# EAGLE schematic AudioAmplifierExample (EAGLE 9.6.2)
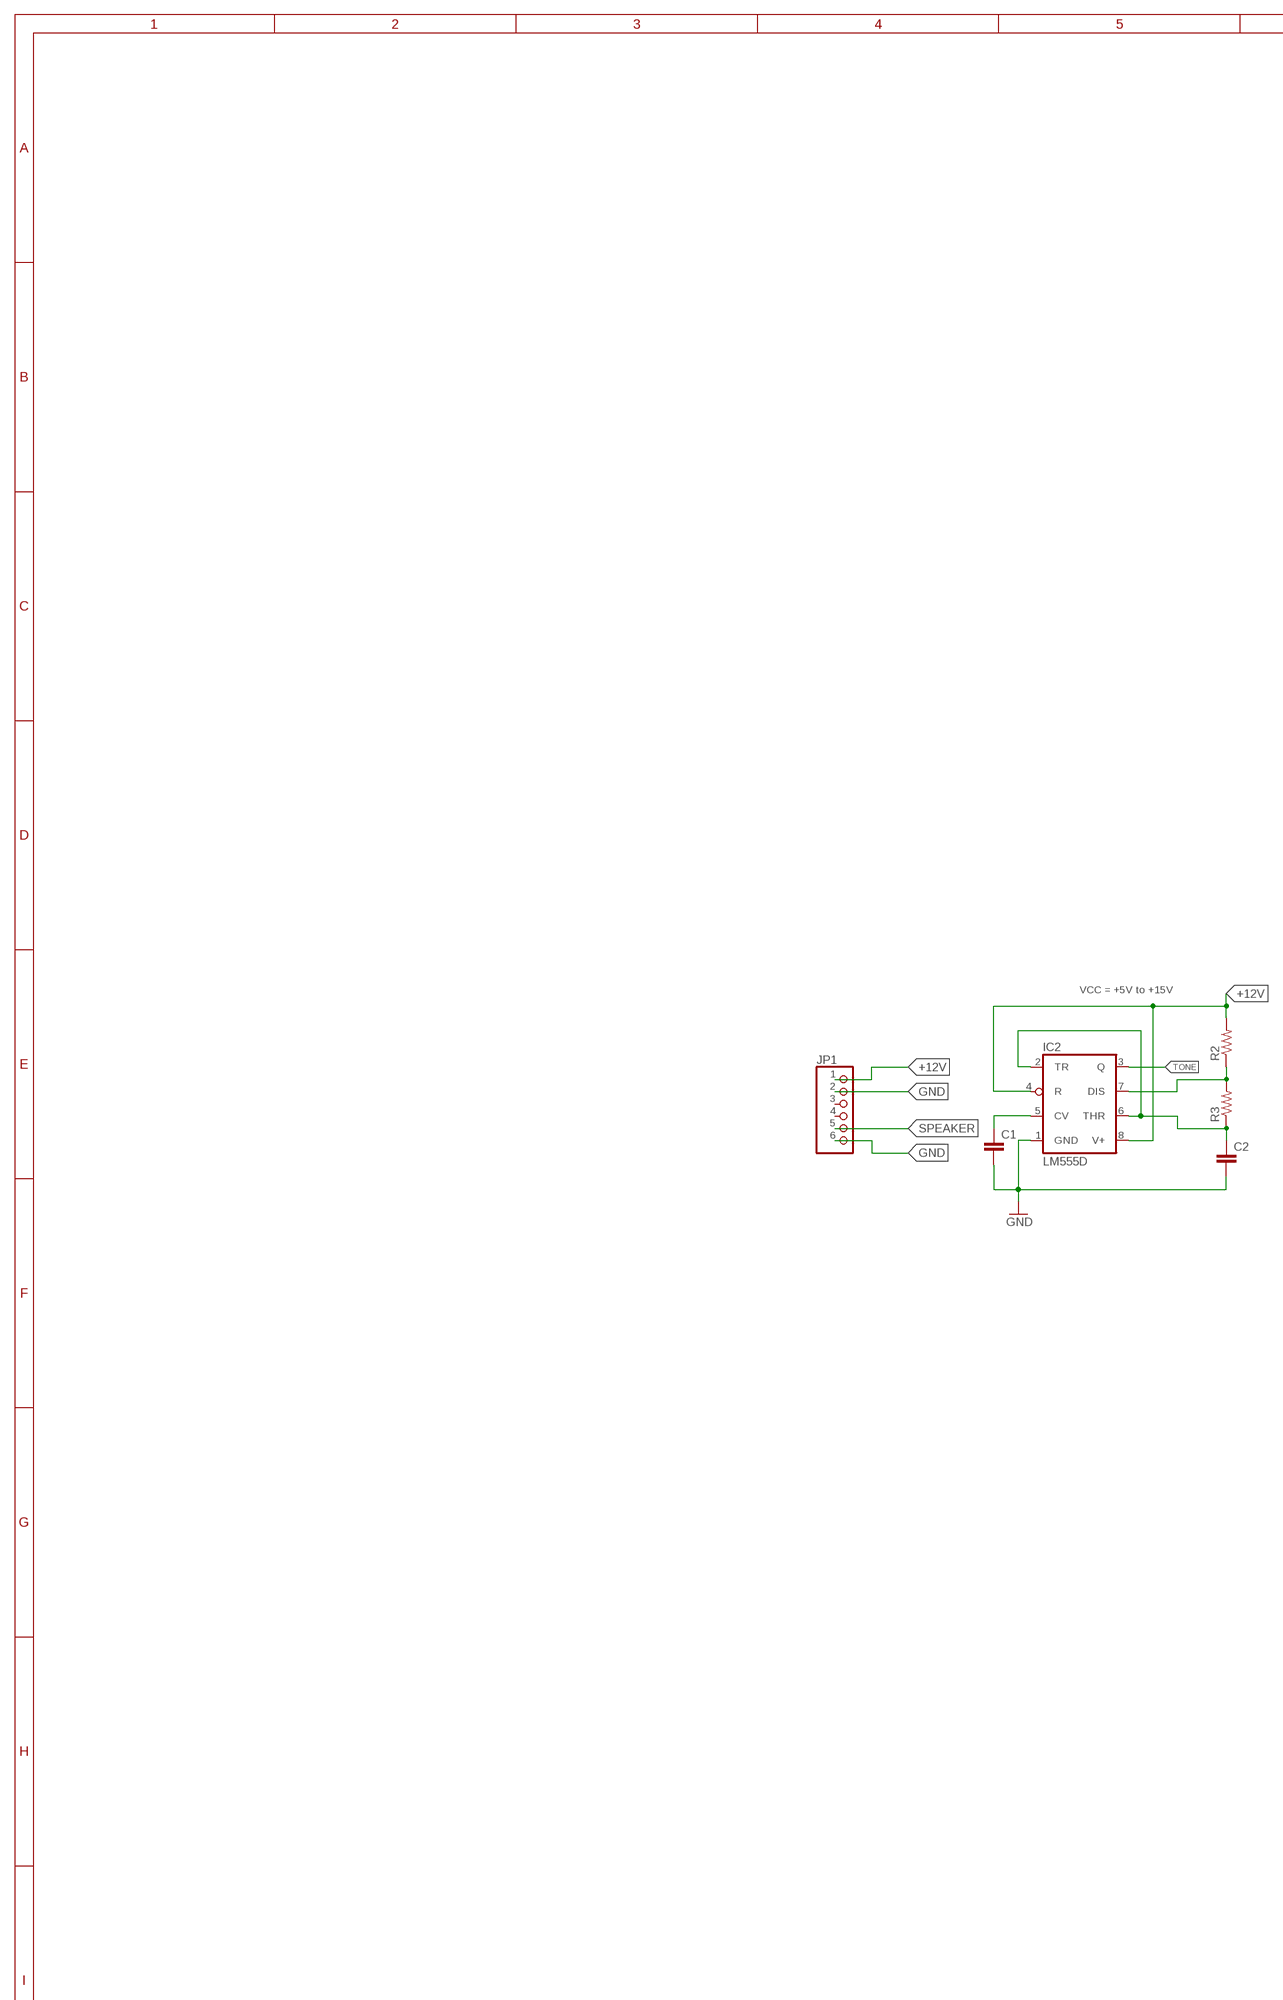
[diagram p0: schematic, sheet 1, part 1 of 2]
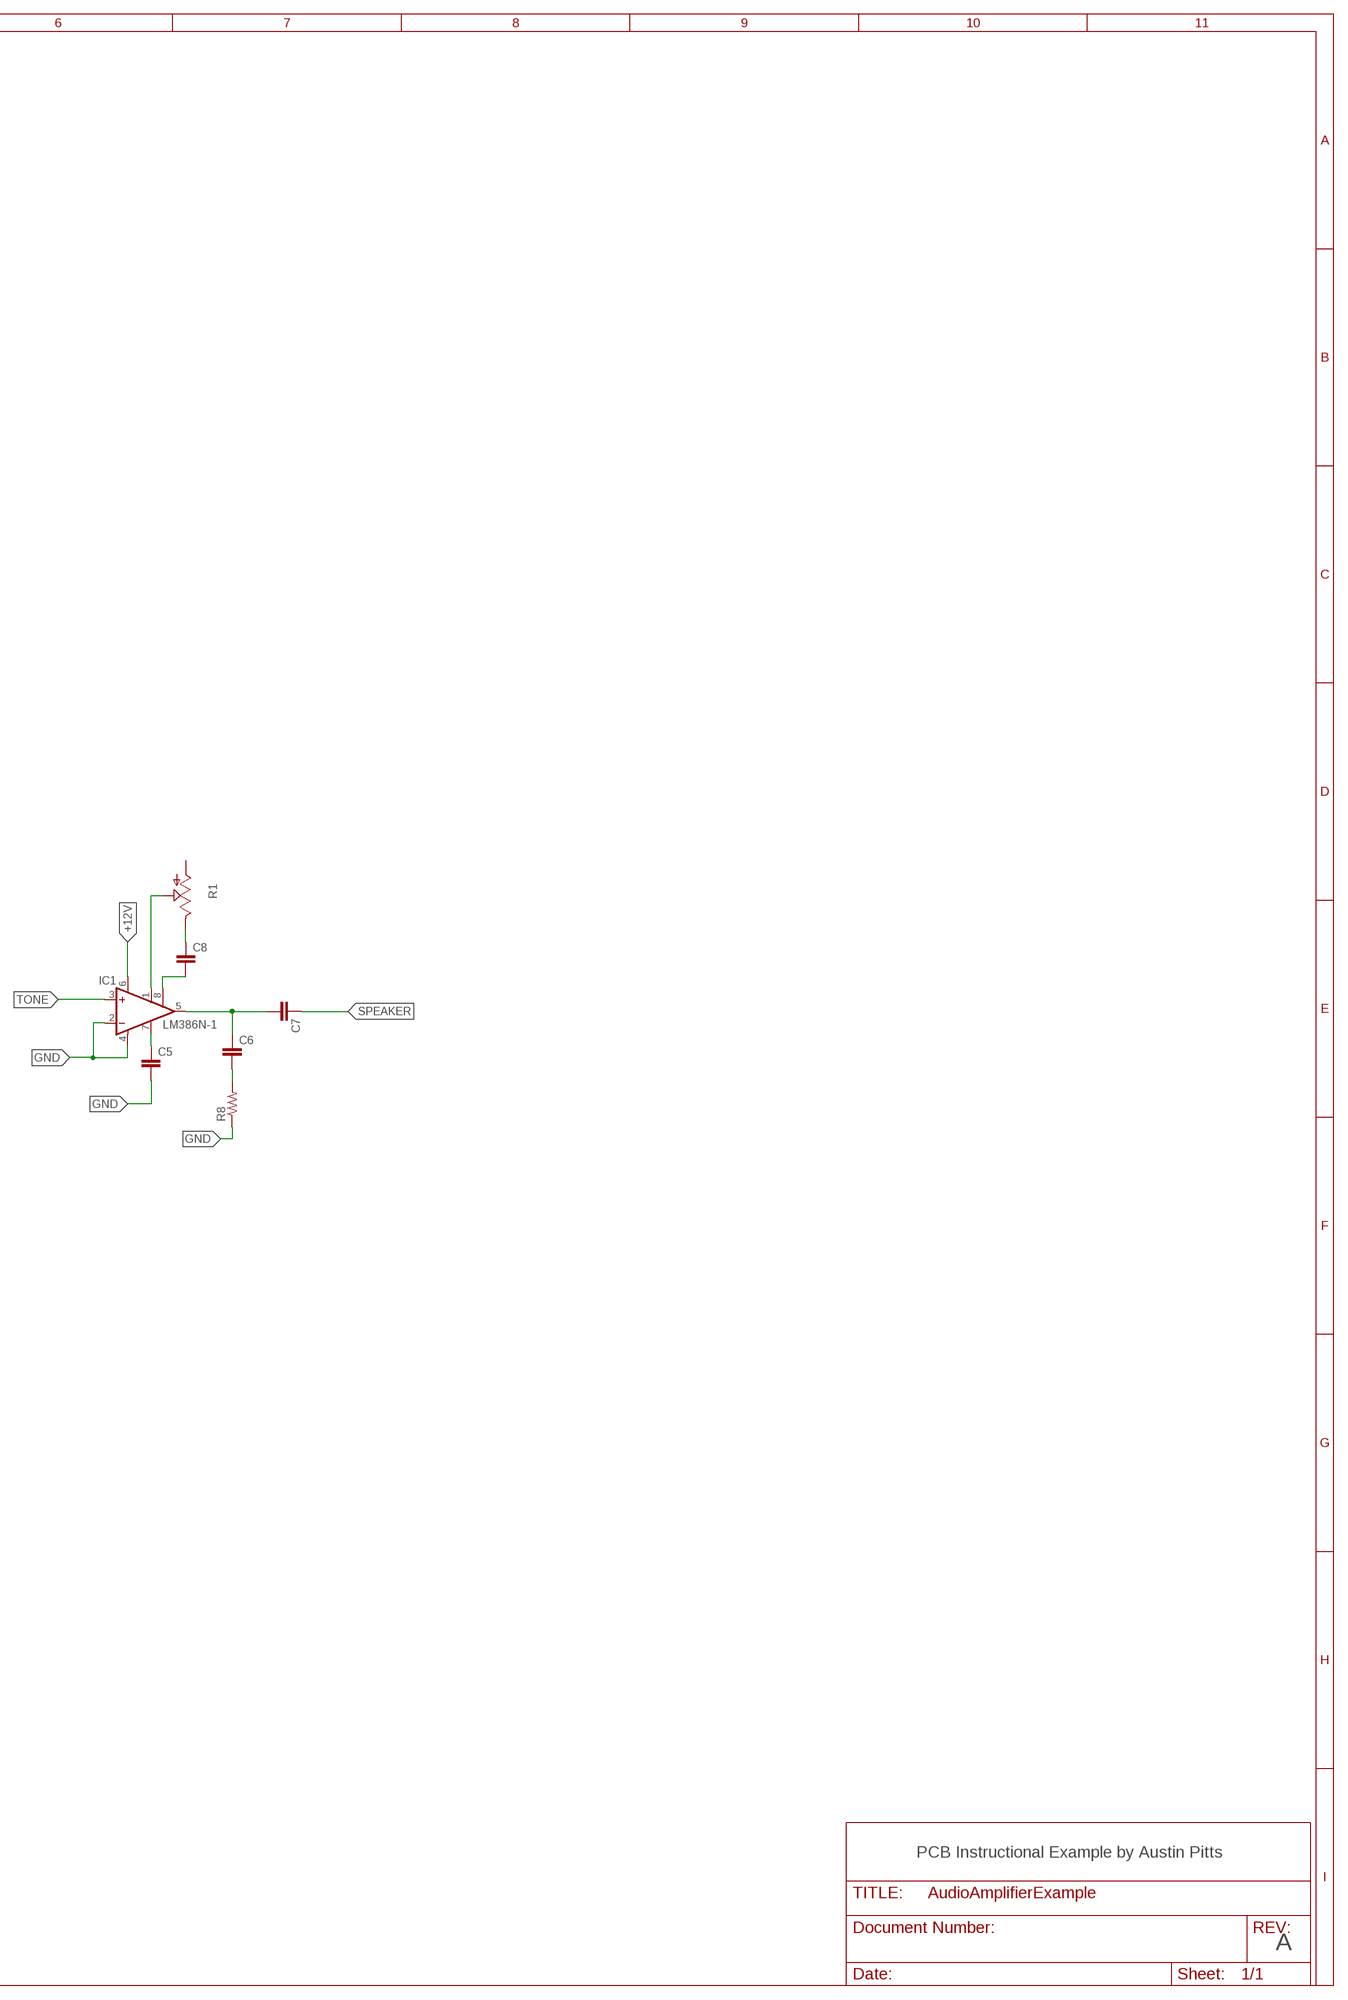
[diagram p1: schematic, sheet 1, part 2 of 2]

## Parts
C1  C2,5-3  [C2.5-3]
C2  C2,5-3  [C2.5-3]
C5  C2,5-3  [C2.5-3]
C6  C2,5-3  [C2.5-3]
C7  C2,5-3  [C2.5-3]
C8  C2,5-3  [C2.5-3]
IC1  LM386N-1  [DIL08@1]
IC2  LM555D  [SO08]
JP1  PINHD-1X6  [1X06]
R1  TRIM_US-B25P  [B25P]
R2  R-US_0207/7  [0207/7]
R3  R-US_0207/7  [0207/7]
R8  R-US_0207/7  [0207/7]

## Nets
+12V [Power]: IC1.6(VS) IC2.4(R) IC2.8(V+) JP1.1 R2.2
GND [Power]: C1.2 C2.2 C5.2 IC1.2(-IN) IC1.4(GND) IC2.1(GND) JP1.2 JP1.6 R8.1
N$1: C2.1 IC2.2(TR) IC2.6(THR) R3.1
N$3: IC2.7(DIS) R2.1 R3.2
N$4: C1.1 IC2.5(CV)
N$5 [Audio]: C6.1 C7.2 IC1.5(OUT)
N$8 [Audio]: C6.2 R8.2
N$9 [Audio]: C5.1 IC1.7(BYPASS)
N$11 [Audio]: C8.2 IC1.8(GAIN)
N$12 [Audio]: C8.1 R1.E
N$13 [Audio]: IC1.1(GAIN) R1.S
SPEAKER [Audio]: C7.1 JP1.5
TONE: IC1.3(+IN) IC2.3(Q)
Unconnected: JP1.3 JP1.4 R1.A

## Notes on the sheet
- VCC = +5V to +15V
- PCB Instructional Example by Austin Pitts
- A

## Library data of the parts
C1 C2 C5-C8 = capacitor-wima:C: CAPACITOR naming: grid - package width
IC1 = linear:LM386?-*: Low Voltage Audio Power Amplifier Source: http://cache.national.com/ds/LM/LM386.pdf
IC2 = linear:*555: TIMER
JP1 = adafruit:PINHD-1X6: PIN HEADER
R1 = pot:TRIM_US-: POTENTIOMETER
R2 R3 R8 = resistor:R-US_: RESISTOR, American symbol

## Net classes
1 Signal: width 0.762 mm, clearance 0.152 mm
2 Power: width 1.524 mm, clearance 0.254 mm
3 Audio: width 0.762 mm, clearance 0.254 mm